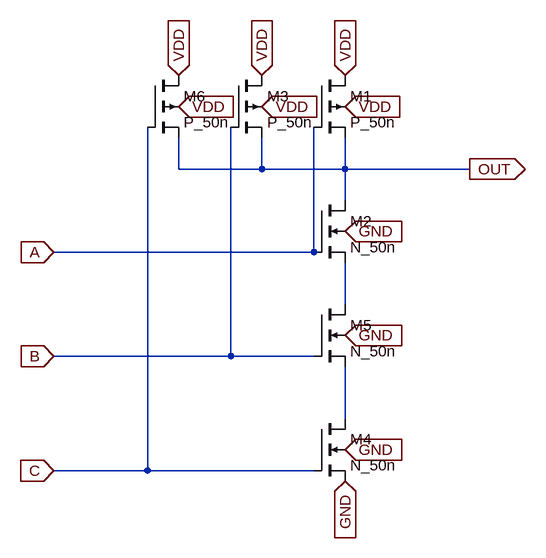
[diagram p0: schematic NAND3.asc]
NAND3.asc, the LTspice schematic file:
Version 4.1
SHEET 1 880 680
WIRE -16 -16 -16 -64
WIRE 112 -16 112 -64
WIRE 112 -16 -16 -16
WIRE 240 -16 240 -64
WIRE 240 -16 112 -16
WIRE 432 -16 240 -16
WIRE 240 32 240 -16
WIRE 192 112 192 -80
WIRE 192 112 -208 112
WIRE 240 192 240 128
WIRE 64 272 64 -80
WIRE 64 272 -208 272
WIRE 192 272 64 272
WIRE 240 368 240 288
WIRE -64 448 -64 -80
WIRE -64 448 -208 448
WIRE 192 448 -64 448
FLAG 112 -160 VDD
IOPIN 112 -160 In
FLAG 112 -112 VDD
IOPIN 112 -112 In
FLAG 240 -112 VDD
IOPIN 240 -112 In
FLAG 240 -160 VDD
IOPIN 240 -160 In
FLAG 240 416 GND
IOPIN 240 416 In
FLAG 240 464 GND
IOPIN 240 464 In
FLAG 240 80 GND
IOPIN 240 80 In
FLAG -208 112 A
IOPIN -208 112 In
FLAG -208 448 C
IOPIN -208 448 In
FLAG 432 -16 OUT
IOPIN 432 -16 Out
FLAG -208 272 B
IOPIN -208 272 In
FLAG -16 -160 VDD
IOPIN -16 -160 In
FLAG -16 -112 VDD
IOPIN -16 -112 In
FLAG 240 240 GND
IOPIN 240 240 In
SYMBOL pmos4 192 -160 R0
SYMATTR InstName M1
SYMATTR Value P_50n
SYMATTR Value2 l=50n w=6u
SYMBOL nmos4 192 32 R0
SYMATTR InstName M2
SYMATTR Value N_50n
SYMATTR Value2 l=50n w=6u
SYMBOL pmos4 64 -160 R0
SYMATTR InstName M3
SYMATTR Value P_50n
SYMATTR Value2 l=50n w=6u
SYMBOL nmos4 192 368 R0
SYMATTR InstName M4
SYMATTR Value N_50n
SYMATTR Value2 l=50n w=6u
SYMBOL nmos4 192 192 R0
SYMATTR InstName M5
SYMATTR Value N_50n
SYMATTR Value2 l=50n w=6u
SYMBOL pmos4 -64 -160 R0
SYMATTR InstName M6
SYMATTR Value P_50n
SYMATTR Value2 l=50n w=6u

The netlist it stands for:
* NAND3.asc
M1 VDD A OUT VDD P_50n l=50n w=6u
M2 OUT A N001 GND N_50n l=50n w=6u
M3 VDD B OUT VDD P_50n l=50n w=6u
M4 N002 C GND GND N_50n l=50n w=6u
M5 N001 B N002 GND N_50n l=50n w=6u
M6 VDD C OUT VDD P_50n l=50n w=6u
.model NMOS NMOS
.model PMOS PMOS
.lib standard.mos
.backanno
.end